# Altium schematic sheet MCU.SchDoc
size A; SheetNumber: 1; SheetTotal: 3
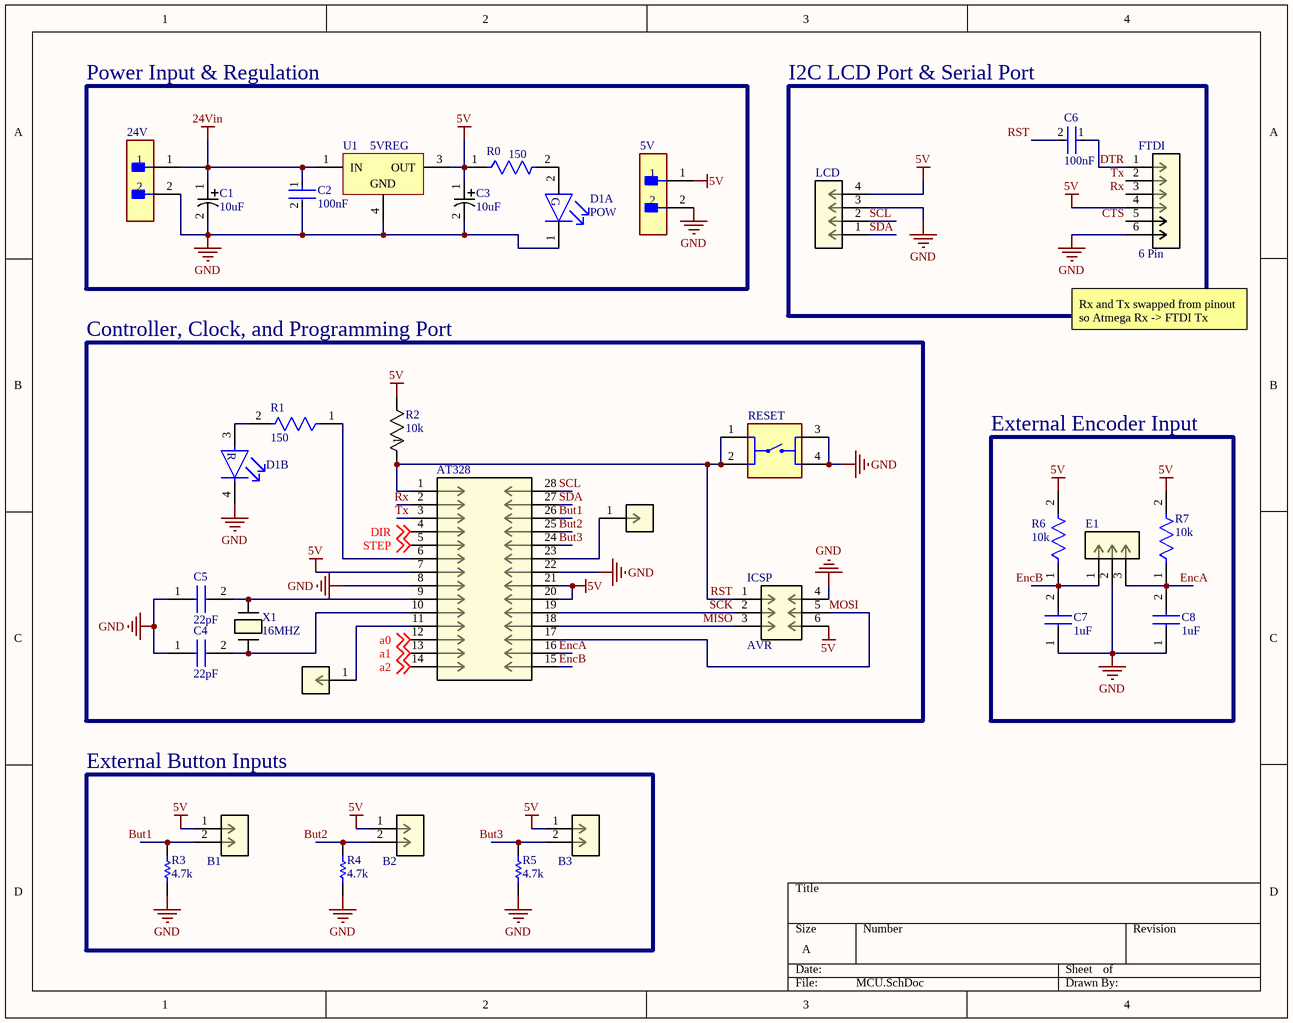
[diagram p0: MCU.SchDoc]

## Parts
5V  (no value)  [FP-TSW-102-07-L-S-MFG]
24V  (no value)  [FP-TSW-102-07-L-S-MFG]
AT328  Atmega328  [CONN28_1-2199298-9_TEC]  (value not drawn)
B1  Header  [1x2StanHeader]  (value not drawn)
B2  Header  [1x2StanHeader]  (value not drawn)
B3  Header  [1x2StanHeader]  (value not drawn)
C1  10uF  [CAP_EEE_C_PAN-M]
C2  100nF  [FP-CL21-IPC_C]
C3  10uF  [CAP_EEE_C_PAN-M]
C4  22pF  [C0805]
C5  22pF  [C0805]
C6  100nF  [FP-CL21-IPC_C]
C7  1uF  [CAPC2012X135N]
C8  1uF  [CAPC2012X135N]
D1  POW  [FP-LTST-C235KGKRKT-MFG]  (parts A,B of 2)
E1  Encoder  [1x3StanHeader]  (value not drawn)
FTDI  6 Pin  [USB FTDI 1x6]
ICSP  AVR  [2x3StanHeader]
JB  Header  [1x1StanHeader]  (value not drawn)
JC  Header  [1x1StanHeader]  (value not drawn)
LCD  LCD  [1x4StanHeader]  (value not drawn)
R0  150  [FP-ERJ6GE-MFG]
R1  150  [FP-ERJ6GE-MFG]
R2  10k  [RES_AC0805_YAG-M]
R3  4.7k  [RESC2013X50X30LL20T20]
R4  4.7k  [RESC2013X50X30LL20T20]
R5  4.7k  [RESC2013X50X30LL20T20]
R6  10k  [FP-MC01W0805-IPC_C]
R7  10k  [FP-MC01W0805-IPC_C]
RESET  Reset  [SW_1825910-6-4]  (value not drawn)
U1  5VREG  [TO-263_M]
X1  16MHZ  [XTAL_ATS-49_CTS]

## Blocks framed on the sheet
Power Input & Regulation: 5V 24V C1-C3 D1 R0 U1
I2C LCD Port & Serial Port: C6 FTDI LCD
Controller, Clock, and Programming Port: AT328 C4 C5 D1 ICSP JB JC R1 R2 RESET X1
External Encoder Input: C7 C8 E1 R6 R7
External Button Inputs: B1-B3 R3-R5

## Nets
5V: 5V.1 AT328.7 AT328.20 AT328.21 B1.1 B2.1 B3.1 C3.1 FTDI.4 ICSP.6 LCD.4 R0.1 R2.2 R6.2 R7.2 U1.3(OUT)
24Vin: 24V.1 C1.1 C2.1 U1.1(IN)
GND: 5V.2 24V.2 AT328.8 AT328.22 C1.2 C2.2 C3.2 C4.1 C5.1 C7.1 C8.1 D1.1(Green_C) D1.4(Red_C) E1.2 FTDI.6 ICSP.4 LCD.3 R3.1 R4.1 R5.1 RESET.3 RESET.4 U1.4(GND)
a0: AT328.12 ; off-sheet a0
a1: AT328.13 ; off-sheet a1
a2: AT328.14 ; off-sheet a2
But1: AT328.26 B1.2 R3.2
But2: AT328.25 B2.2 R4.2
But3: AT328.24 B3.2 R5.2
CTS: FTDI.5
DIR: AT328.4 ; off-sheet DIR
DTR: C6.1 FTDI.1
EncA: AT328.16 C8.2 E1.3 R7.1
EncB: AT328.15 C7.2 E1.1 R6.1
MISO: AT328.18 ICSP.3
MOSI: AT328.17 ICSP.5
RST: AT328.1 C6.2 ICSP.1 R2.1 RESET.1 RESET.2
Rx: AT328.2 FTDI.3
SCK: AT328.19 ICSP.2
SCL: AT328.28 LCD.2
SDA: AT328.27 LCD.1
STEP: AT328.5 ; off-sheet STEP
Tx: AT328.3 FTDI.2
NetAT328_6: AT328.6 R1.1
NetAT328_9: AT328.9 C5.2 X1.2
NetAT328_10: AT328.10 C4.2 X1.1
NetAT328_11: AT328.11 JB.1
NetAT328_23: AT328.23 JC.1
NetD1_2: D1.2(Green_A) R0.2
NetD1_3: D1.3(Red_A) R1.2

## Notes on the sheet
- Rx and Tx swapped from pinout so Atmega Rx -> FTDI Tx
- (in symbol CMP-22017-000042-1, part A) G
- (in symbol CMP-22017-000042-1, part B) R

## Library data of the parts
5V 24V = CMP-02766-001428-1: CONN HEADER VERT 2POS 2.54MM   TSW-102-07-L-S; Voltage Rating: 550V; Current Rating: 7.6A; Gender: Male; Number of Contacts: 2; Connector Type: Male Pin; Radiation Hardening: No; Orientation: Straight; Contact Plating: Gold; Max Operating Temperature: 125°C; Mount: Through Hole; Package Quantity: 1; Number of Rows: 1; Housing Material: Polyester; RoHS Compliant: Yes; Length: 5.08mm; Max Voltage Rating (AC): 550V; Pitch: 2.54mm; Packaging: Bulk; Depth: 2.54mm; Termination: Solder; Min Operating Temperature: -55°C; Housing Color: Black; Lead Free: Lead Free; Color: Black; Number of Positions: 2; Width: 2.54mm; Max Current Rating: 7.6A; REACH SVHC: No SVHC; Contact Material: Bronze; Contact Mating Length: 0.23inch; Series: TSW; Contact Type: Male Pin
AT328 = 14x2_J: No Description Available   1-2199298-9; Mfr_Name: TE Connectivity; Type: DEV; Copyright: Copyright (C) 2022 Ultra Librarian. All rights reserved.; Manufacturer_Part_Number: 1-2199298-9; RefDes: RefDes
B1-B3 = 2x1_J: No Description Available; Manufacturer_Part_Number: 5-826631-0; Vendor: TE Connectivity; Built_By: EMA_UL_Team; SourceLibrary: Tyco_2012-04-26; Copyright: Copyright (C) 2018 Accelerated Designs. All rights reserved; RefDes: RefDes; Type: DEV
C1 C3 = EEE-1VA100SR: Mfr_Name: Panasonic; Type: DEV; Copyright: Copyright (C) 2022 Ultra Librarian. All rights reserved.; Manufacturer_Part_Number: EEE-1VA100SR; RefDes: RefDes
C2 C6 = CMP-2000-05017-2: CL21 Series 0805 100nF 50V ±10% Tolerance X7R Multilayer Ceramic Chip Capacitor CL21B104KBCNNNC; Depth: 1.25mm; Height: 0.85mm; Width: 0.049inch; Tolerance: 10%; Case Code (Metric): 2012; Case Code (Imperial): 0805; Material: Ceramic; Thickness: 0.037inch; Min Operating Temperature: -55°C; Contact Plating: Tin; Length: 2mm; Mount: Surface Mount; Voltage Rating (DC): 50V; Lead Free: Lead Free; Dielectric: X7R; Radiation Hardening: No; Capacitance: 100nF; Voltage Rating: 50V; Case/Package: 0805; Packaging: Tape and Reel; Max Operating Temperature: 125°C; Voltage: 50V
C4 C5 = C0805C220J4GACTU: Capacitor C0805C220J4GACTU; Manufacturer_Name: KEMET; Datasheet Link: https://componentsearchengine.com//C0805C220J4GACTU.pdf; Height: 1.1mm; Mouser2 Part Number: 80-C0805C220J4GACTU; Mouser2 Price/Stock: https://www.mouser.com/Search/Refine.aspx?Keyword=80-C0805C220J4GACTU; Manufacturer_Part_Number: C0805C220J4GACTU
C7 C8 = CL21B105KAFNNNE: Capacitor CL21B105KAFNNNE; Manufacturer_Name: Samsung Electro-Mechanics; Datasheet Link: https://media.digikey.com/pdf/Data%20Sheets/Samsung%20PDFs/CL_Series_MLCC_ds.pdf; Height: 1.35mm; Manufacturer_Part_Number: CL21B105KAFNNNE; Mouser Part Number: 187-CL21B105KAFNNNE; Mouser Price/Stock: https://www.mouser.co.uk/ProductDetail/Samsung-Electro-Mechanics/CL21B105KAFNNNE?qs=349EhDEZ59rlwSnoUrPIow%3D%3D; Arrow Part Number: CL21B105KAFNNNE; Arrow Price/Stock: https://www.arrow.com/en/products/cl21b105kafnnne/samsung-electro-mechanics
D1 = CMP-22017-000042-1: LED GREEN/RED CLEAR CHIP SMD LTST-C235KGKRKT; Luminous Intensity: 45mcd; Power Rating: 75mW; Forward Voltage: 2V; Illumination Color: Green; Number of LEDs: 2; Lens Color: Colorless; Test Current: 20mA; Dominant Wavelength: 631nm; Viewing Angle: 130°; Reverse Voltage: 5V; Mount: Surface Mount; Case/Package: SMD/SMT; Case Code (Metric): 3216; Case Code (Imperial): 1206; Height: 1.1mm; Color: Green; Package Quantity: 1; Radiation Hardening: No; Width: 1.6mm; Lens Transparency: Clear; Depth: 1.6mm; Lens Style: Clear; Forward Current: 20mA; Number of Pins: 4; Power Dissipation: 75mW; Min Operating Temperature: -30°C; Length: 3.2mm; Lead Free: Lead Free; Packaging: Tape and Reel; Max Operating Temperature: 85°C; Number of Elements: 2; RoHS Compliant: Yes
E1 = 3x1_J: No Description Available; Manufacturer_Part_Number: 5-826631-0; Vendor: TE Connectivity; Built_By: EMA_UL_Team; SourceLibrary: Tyco_2012-04-26; Copyright: Copyright (C) 2018 Accelerated Designs. All rights reserved; RefDes: RefDes; Type: DEV
FTDI = FTDI USB: No Description Available; Manufacturer_Part_Number: 5-826631-0; Vendor: TE Connectivity; Built_By: EMA_UL_Team; SourceLibrary: Tyco_2012-04-26; Copyright: Copyright (C) 2018 Accelerated Designs. All rights reserved; RefDes: RefDes; Type: DEV
ICSP = 2x3_J: No Description Available; Manufacturer_Part_Number: 5-826631-0; Vendor: TE Connectivity; Built_By: EMA_UL_Team; SourceLibrary: Tyco_2012-04-26; Copyright: Copyright (C) 2018 Accelerated Designs. All rights reserved; RefDes: RefDes; Type: DEV
JB JC = 1x1_J: No Description Available; Manufacturer_Part_Number: 5-826631-0; Vendor: TE Connectivity; Built_By: EMA_UL_Team; SourceLibrary: Tyco_2012-04-26; Copyright: Copyright (C) 2018 Accelerated Designs. All rights reserved; RefDes: RefDes; Type: DEV
LCD = 4x1_J: No Description Available; Manufacturer_Part_Number: 5-826631-0; Vendor: TE Connectivity; Built_By: EMA_UL_Team; SourceLibrary: Tyco_2012-04-26; Copyright: Copyright (C) 2018 Accelerated Designs. All rights reserved; RefDes: RefDes; Type: DEV
R0 R1 = CMP-1013-00054-3: RES SMD 150 OHM 5% 1/8W 0805 ERJ-6GEYJ151V; Manufacturer: Panasonic; Temperature Coefficient: 200ppm/°C; Voltage Rating: 150V; Value: 150Ω; Power Rating: 0.125W; Automotive Grade: Grade 0; RoHS: TRUE; Series: ERJ; Tolerance: 5%; Height: 0.7mm; Device Class L1: Passive Components; Temperature Range Low: -55°C; Device Class L3: Chip SMD Resistors; Lead Free: Yes; Manufacturer Part Number: ERJ-6GEYJ151V; Composition: Thick Film; Temperature: -55°C to +155°C; Mouser Description: Thick Film Resistors - SMD 0805 150ohms 5% Tol; Footprint Url: https://industrial.panasonic.com/cdbs/www-data/pdf/RDA0000/DMA0000COL17.pdf; Device Class L2: Resistors; Category: Res; Ipc Land Pattern Name: RESC200125X60; Temperature Range High: +155°C; ComponentLink2URL: https://industrial.panasonic.com/ww/products/resistors/chip-resistors/general-purpose-chip-resistors/thick-film-chip-resistors/ERJ6GEYJ151V; Package: ERJ6GE; Digikey Description: RES SMD 150 OHM 5% 1/8W 0805; Resistance: 150Ω; ComponentLink2Description: Datasheet; Octopart: https://octopart.com/erj-6geyj151v-panasonic-55422917; Automotive: Yes
R2 = AC0805FR-070RL: Mfr_Name: Yageo; Copyright: Copyright (C) 2022 Ultra Librarian. All rights reserved.; Manufacturer_Part_Number: AC0805FR-070RL; RefDes: RefDes; Type: DEV
R3-R5 = CMP-2001-03968-1: CRCW08054K70JNEB; Manufacturer: Vishay Dale; Part Number: CRCW08054K70JNEB
R6 R7 = CMP-12256-000003-1: Resistor, 10K, 0.1W, 1%, 0805, Reel MC01W0805110K; Resistance: 10kR; Voltage Rating: 150V; Temperature Coefficient: 100ppm/°C; Power Rating: 100mW; REACH SVHC: No SVHC; Composition: Thick Film; Max Operating Temperature: 155°C; Case/Package: 0805; Tolerance: 1%; Number of Pins: 2; Case Code (Metric): 2012; Voltage Rating (DC): 150V; Min Operating Temperature: -55°C; Width: 1.25mm; Case Code (Imperial): 0805; Packaging: Cut Tape
RESET = CMP-009-000000-1: Switch Tactile OFF (ON) SPST Round Button PC Pins 0.05A 24VDC 100000Cycles 1.57N Thru-Hole Loose; Value: *; Package: None; Pin Count: 4; Price: None; Component Type: Standard; Design Item ID: 1825910-6; Source: 1825910-6.SchLib; Availability: Unavailable; MP: 1825910-6
U1 = CMP-0244-00213-1: Positive Voltage Regulator, 3-Pin D2PAK, Tape and Reel L7805CD2T-TR; PackageReference: TO-263; ComponentLink2URL: http://www.st.com/internet/com/TECHNICAL_RESOURCES/TECHNICAL_LITERATURE/DATASHEET/CD00000444.pdf; PackageDescription: 3-Pin Transistor Outline Package 2.54 mm Pitch, 15.4 mm Lead Span (D2PAK); DatasheetVersion: 16/11/2011; ComponentLink2Description: Datasheet; ComponentLink1Description: Manufacturer URL; PackageVersion: 2011; ComponentLink1URL: http://www.st.com
X1 = ATS-49/U-16.0000MHZ: Mfr_Name: CTS Components; Copyright: Copyright (C) 2022 Ultra Librarian. All rights reserved.; Manufacturer_Part_Number: ATS-49/U-16.0000MHZ; RefDes: RefDes; Type: DEV